# Altium schematic sheet PMIC.SchDoc
size A4; SheetNumber: 4; SheetTotal: 22
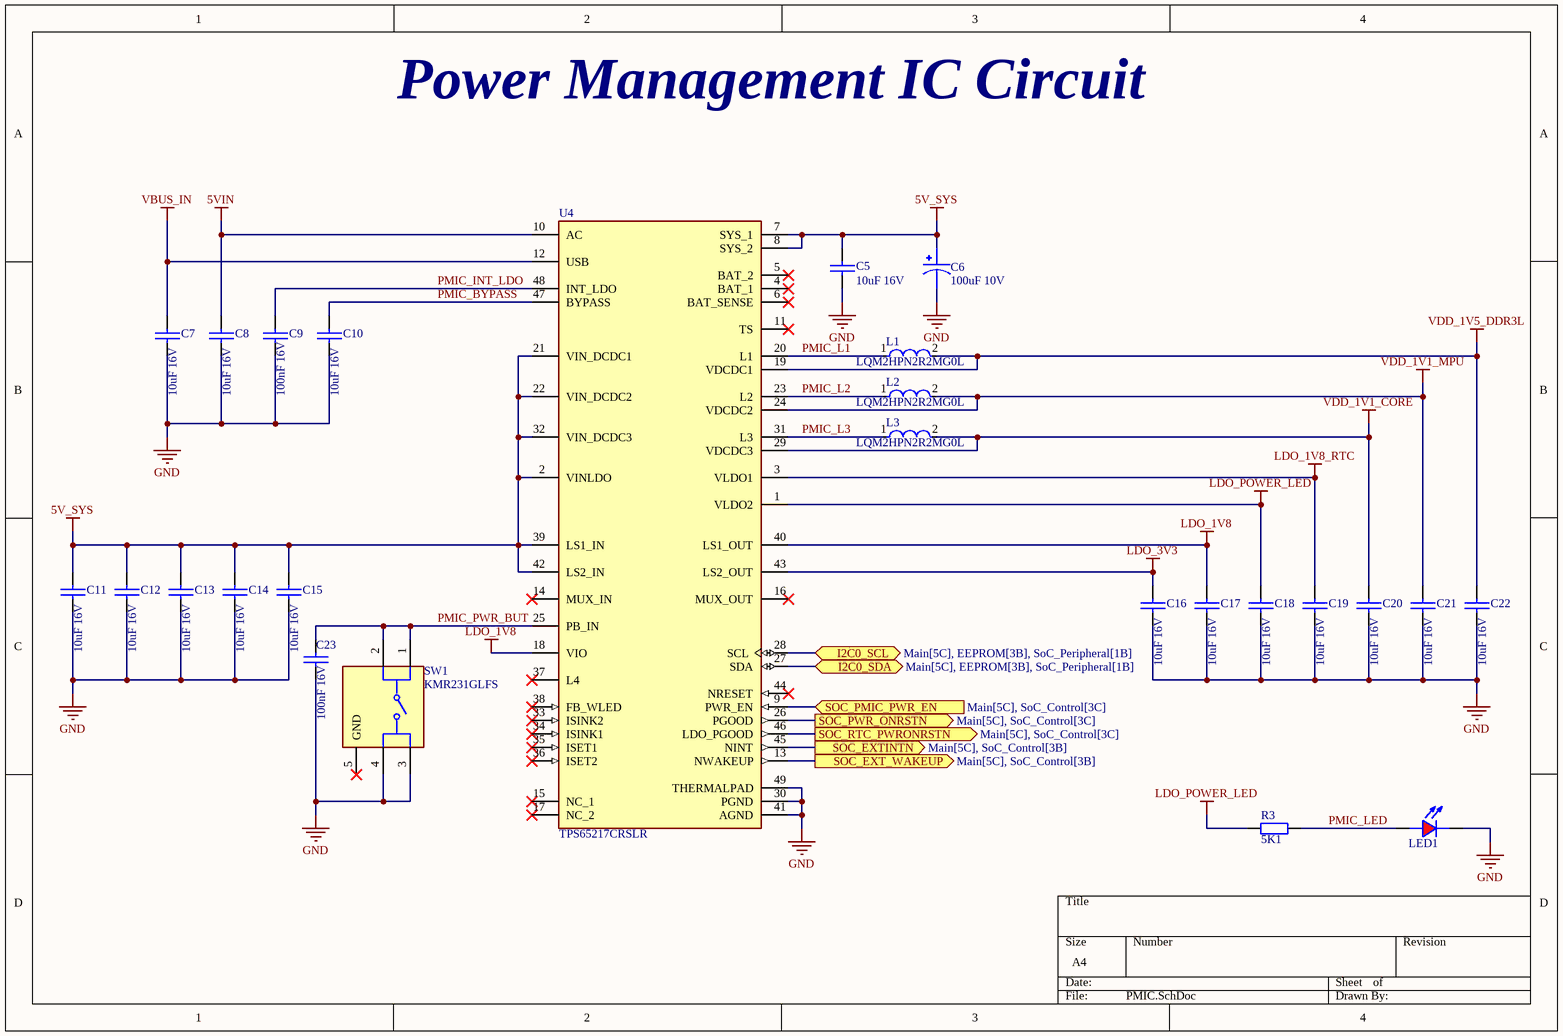
[diagram p0: PMIC.SchDoc]

## Parts
C5  10uF 16V  [C_0603]
C6  100uF 10V  [C_CASE-B]
C7  10uF 16V  [C_0603]
C8  10uF 16V  [C_0603]
C9  100nF 16V  [C_0402]
C10  10uF 16V  [C_0603]
C11  10uF 16V  [C_0603]
C12  10uF 16V  [C_0603]
C13  10uF 16V  [C_0603]
C14  10uF 16V  [C_0603]
C15  10uF 16V  [C_0603]
C16  10uF 16V  [C_0603]
C17  10uF 16V  [C_0603]
C18  10uF 16V  [C_0603]
C19  10uF 16V  [C_0603]
C20  10uF 16V  [C_0603]
C21  10uF 16V  [C_0603]
C22  10uF 16V  [C_0603]
C23  100nF 16V  [C_0402]
L1  LQM2HPN2R2MG0L  [FP-LQM2HPN_G0-IPC_C]
L2  LQM2HPN2R2MG0L  [FP-LQM2HPN_G0-IPC_C]
L3  LQM2HPN2R2MG0L  [FP-LQM2HPN_G0-IPC_C]
LED1  LED_0603_RED  [LED_0603]  (value not drawn)
R3  5K1  [R_0603]
SW1  KMR231GLFS  [FP-KMR231GLFS-MFG]
U4  TPS65217CRSLR  [QFN40P600X600X100-49N-D]

## Ports
I2C0_SCL (bidir, see Main[5C], EEPROM[3B], SoC_Peripheral[1B]), I2C0_SDA (bidir, see Main[5C], EEPROM[3B], SoC_Peripheral[1B]), SOC_EXT_WAKEUP (out, see Main[5C], SoC_Control[3B]), SOC_EXTINTN (out, see Main[5C], SoC_Control[3B]), SOC_PMIC_PWR_EN (in, see Main[5C], SoC_Control[3C]), SOC_PWR_ONRSTN (out, see Main[5C], SoC_Control[3C]), SOC_RTC_PWRONRSTN (out, see Main[5C], SoC_Control[3C])

## Nets
5V_SYS: C5.1 C6.1 C11.1 C12.1 C13.1 C14.1 C15.1 U4.2(VINLDO) U4.7(SYS_1) U4.8(SYS_2) U4.21(VIN_DCDC1) U4.22(VIN_DCDC2) U4.32(VIN_DCDC3) U4.39(LS1_IN) U4.42(LS2_IN)
5VIN: C8.1 U4.10(AC)
GND: C5.2 C6.2 C7.2 C8.2 C9.2 C10.2 C11.2 C12.2 C13.2 C14.2 C15.2 C16.2 C17.2 C18.2 C19.2 C20.2 C21.2 C22.2 C23.2 LED1.2(C) SW1.3 SW1.4 U4.30(PGND) U4.41(AGND) U4.49(THERMALPAD)
LDO_1V8: C17.1 U4.18(VIO) U4.40(LS1_OUT)
LDO_1V8_RTC: C19.1 U4.3(VLDO1)
LDO_3V3: C16.1 U4.43(LS2_OUT)
LDO_POWER_LED: C18.1 R3.2 U4.1(VLDO2)
VBUS_IN: C7.1 U4.12(USB)
VDD_1V1_CORE: C20.1 L3.2 U4.29(VDCDC3)
VDD_1V1_MPU: C21.1 L2.2 U4.24(VDCDC2)
VDD_1V5_DDR3L: C22.1 L1.2 U4.19(VDCDC1)
I2C0_SCL: U4.28(SCL) ; port I2C0_SCL
I2C0_SDA: U4.27(SDA) ; port I2C0_SDA
PMIC_BYPASS: C10.1 U4.47(BYPASS)
PMIC_INT_LDO: C9.1 U4.48(INT_LDO)
PMIC_L1: L1.1 U4.20(L1)
PMIC_L2: L2.1 U4.23(L2)
PMIC_L3: L3.1 U4.31(L3)
PMIC_LED: LED1.1(A) R3.1
PMIC_PWR_BUT: C23.1 SW1.1 SW1.2 U4.25(PB_IN)
SOC_EXT_WAKEUP: U4.13(NWAKEUP) ; port SOC_EXT_WAKEUP
SOC_EXTINTN: U4.45(NINT) ; port SOC_EXTINTN
SOC_PMIC_PWR_EN: U4.9(PWR_EN) ; port SOC_PMIC_PWR_EN
SOC_PWR_ONRSTN: U4.26(PGOOD) ; port SOC_PWR_ONRSTN
SOC_RTC_PWRONRSTN: U4.46(LDO_PGOOD) ; port SOC_RTC_PWRONRSTN

Not connected (* = marked no-connect by the designer): SW1 5(GND)*; U4 4(BAT_1)* 5(BAT_2)* 6(BAT_SENSE)* 11(TS)* 14(MUX_IN)* 15(NC_1)* 16(MUX_OUT)* 17(NC_2)* 33(ISINK2)* 34(ISINK1)* 35(ISET1)* 36(ISET2)* 37(L4)* 38(FB_WLED)* 44(NRESET)*

## Notes on the sheet
- Power Management IC Circuit

## Library data of the parts
C5 C7 C8 C10-C22 = C_0603: Capacitor 0603 SMD
C6 = C_CASE-B-3528-21: Tantalum capacitor CASE-B-3528-21
C9 C23 = C_0402: Capacitor 0402 SMD
L1-L3 = CMP-1662-00028-2: Multilayer Type Inductor for Power Lines, 1008 (2520), 2.2μH, 20%, 0.1Ω, 1.3A; Core Material: Ferrite; DC Resistance (DCR): 100mR; Inductance: 2.2uH; Test Frequency: 1MHz; Self Resonant Frequency: 40MHz; Shielding: Shielded; Depth: 2.2mm; Length: 2.5mm; Max DC Current: 1.3A; Military Standard: Not; Current Rating: 1.3A; Termination: SMD/SMT; Radiation Hardening: No; Tolerance: 20%; Height: 1.2mm; Case Code (Metric): 2520; DC Current: 1.3A; Inductance Tolerance: 20%; Packaging: Tape and Reel; Width: 2mm; REACH SVHC: No SVHC; Mount: Surface Mount; Max Operating Temperature: 125°C; Lead Free: Lead Free; Case/Package: 1008; Case Code (Imperial): 1008; Series: LQM2HP_G0; Height - Seated (Max): 0.039inch; Package Quantity: 3000; Min Operating Temperature: -55°C
R3 = R_0603: Resistor 0603 SMD
SW1 = CMP-2000-06516-3: SWITCH TACTILE SPST-NO 0.05A 32V; Switch Travel: 0.25mm; Current Rating: 50mA; Operating Force: 3N; Actuator Type: Standard; Illumination Type: Non-Illuminated; Mechanical Life: 150000Cycles; Insulation Resistance: 1GR; Contact Resistance: 100mR; Actuator Length: 0.5mm; Power Rating: 1W; Throw Configuration: SPST; Switch Function: Off-Mom; Min Operating Temperature: -40°C; Termination: Gull Wing; Orientation: Straight; Lead Free: Lead Free; Width: 2.8mm; Contact Material: Silver; Max Voltage Rating (DC): 32V; Max Current Rating: 50mA; Contact Plating: Silver; Radiation Hardening: No; Depth: 4.6mm; Mount: Surface Mount; Max Operating Temperature: 85°C; Case/Package: SMD/SMT; Contact Current Rating: 50mA; Length: 4.6mm; Package Quantity: 7000; Series: KMR2; REACH SVHC: No SVHC; Packaging: Cut Tape; Voltage Rating (DC): 32V
U4 = TPS65217CRSLR: TPS65217 Single-Chip PMIC for Battery-Powered Systems; Manufacturer: Texas Instruments; Manufacturer Part Number: TPS65217CRSLR; Datasheet Link: https://www.ti.com/lit/ds/symlink/tps65217.pdf